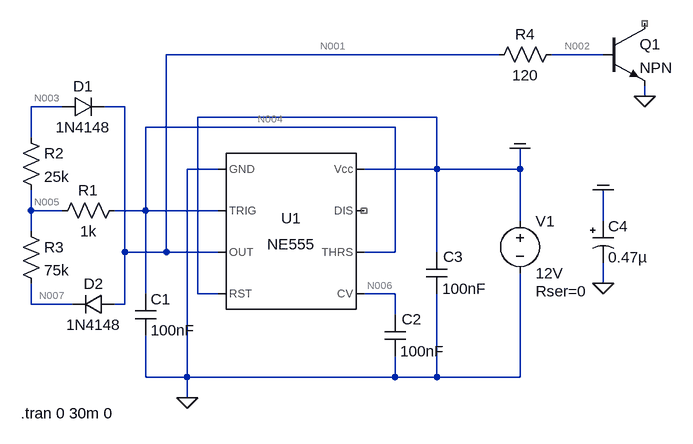
[diagram p0: schematic wil.asc]
wil.asc, the LTspice schematic file:
Version 4
SHEET 1 880 680
WIRE 544 -96 32 -96
WIRE 704 -96 624 -96
WIRE 768 -32 768 -48
WIRE -128 -16 -176 -16
WIRE -32 -16 -64 -16
WIRE 448 0 80 0
WIRE 384 16 0 16
WIRE -176 32 -176 -16
WIRE 112 80 64 80
WIRE 448 80 448 0
WIRE 448 80 336 80
WIRE 576 80 576 48
WIRE 576 80 448 80
WIRE -176 144 -176 112
WIRE -128 144 -176 144
WIRE 0 144 0 16
WIRE 0 144 -48 144
WIRE 112 144 0 144
WIRE 576 160 576 80
WIRE 704 160 704 112
WIRE -176 176 -176 144
WIRE -32 208 -32 -16
WIRE 32 208 32 -96
WIRE 32 208 -32 208
WIRE 112 208 32 208
WIRE 384 208 384 16
WIRE 384 208 336 208
WIRE 448 208 448 80
WIRE 704 256 704 224
WIRE 0 272 0 144
WIRE 80 272 80 0
WIRE 112 272 80 272
WIRE 384 272 336 272
WIRE -176 288 -176 256
WIRE -112 288 -176 288
WIRE -32 288 -32 208
WIRE -32 288 -48 288
WIRE 384 304 384 272
WIRE 0 400 0 336
WIRE 64 400 64 80
WIRE 64 400 0 400
WIRE 384 400 384 368
WIRE 384 400 64 400
WIRE 448 400 448 272
WIRE 448 400 384 400
WIRE 576 400 576 240
WIRE 576 400 448 400
WIRE 64 432 64 400
FLAG 64 432 0
FLAG 704 256 0
FLAG 576 48 COM
FLAG 704 112 COM
FLAG 768 -32 0
SYMBOL Misc\\NE555 224 176 R0
SYMATTR InstName U1
SYMBOL diode -128 0 R270
WINDOW 0 32 32 VTop 2
WINDOW 3 0 32 VBottom 2
SYMATTR InstName D1
SYMATTR Value 1N4148
SYMBOL diode -48 272 R90
WINDOW 0 0 32 VBottom 2
WINDOW 3 32 32 VTop 2
SYMATTR InstName D2
SYMATTR Value 1N4148
SYMBOL res -32 128 R90
WINDOW 0 0 56 VBottom 2
WINDOW 3 32 56 VTop 2
SYMATTR InstName R1
SYMATTR Value 1k
SYMBOL res -192 16 R0
SYMATTR InstName R2
SYMATTR Value 25k
SYMBOL res -192 160 R0
SYMATTR InstName R3
SYMATTR Value 75k
SYMBOL cap -16 272 R0
SYMATTR InstName C1
SYMATTR Value 100nF
SYMBOL cap 368 304 R0
WINDOW 0 26 7 Left 2
SYMATTR InstName C2
SYMATTR Value 100nF
SYMBOL cap 432 208 R0
WINDOW 0 26 7 Left 2
SYMATTR InstName C3
SYMATTR Value 100nF
SYMBOL voltage 576 144 R0
WINDOW 123 0 0 Left 2
WINDOW 39 24 124 Left 2
SYMATTR SpiceLine Rser=0
SYMATTR InstName V1
SYMATTR Value 12V
SYMBOL polcap 688 160 R0
WINDOW 3 24 56 Left 2
SYMATTR InstName C4
SYMATTR Value 0.47µ
SYMATTR Description Capacitor
SYMATTR Type cap
SYMATTR SpiceLine V=50 Irms=22m Rser=3.9 Lser=0 mfg="Nichicon" pn="UPL1HR47MAH" type="Al electrolytic"
SYMBOL res 640 -112 R90
WINDOW 0 0 56 VBottom 2
WINDOW 3 32 56 VTop 2
SYMATTR InstName R4
SYMATTR Value 120
SYMBOL npn 704 -144 R0
SYMATTR InstName Q1
TEXT -192 456 Left 2 !.tran 0 30m 0

The netlist it stands for:
* wil.asc
XU1 0 N004 N001 COM N006 N004 NC_01 COM NE555  ; pins GND TRIG OUT RST CV THRS DIS Vcc
D1 N003 N001 1N4148
D2 N001 N007 1N4148
R1 N004 N005 1k
R2 N003 N005 25k
R3 N005 N007 75k
C1 N004 0 100nF
C2 N006 0 100nF
C3 COM 0 100nF
V1 COM 0 12V Rser=0
C4 COM 0 0.47µ V=50 Irms=22m Rser=3.9 Lser=0 mfg="Nichicon" pn="UPL1HR47MAH" type="Al electrolytic"
R4 N002 N001 120
Q1 NC_02 N002 0 0 NPN
.model D D
.lib standard.dio
.model NPN NPN
.model PNP PNP
.lib standard.bjt
.tran 0 30m 0
.lib NE555.sub
.backanno
.end

* Results of the author's LTspice run, read from the files saved beside the schematic
* Operating Point, zero values left out:
*   V(n004) = 11.37 V
*   V(n006) = 8 V
*   V(com) = 12 V
*   V(n001) = 11.47 V
*   V(n003) = 11.37 V
*   V(n007) = 11.37 V
*   V(n005) = 11.37 V
*   V(n002) = 907.5 mV
*   Ib(Q1) = 88.04 mA
*   Ie(Q1) = -88.04 mA
*   I(D2) = 20.49 nA
*   I(D1) = -2.253 nA
*   I(R4) = -88.04 mA
*   I(R3) = -20.49 nA
*   I(R2) = 2.253 nA
*   I(R1) = -22.74 nA
*   I(V1) = -91.92 mA
*   Ix(u1:1) = -3.881 mA
*   Ix(u1:2) = 11.37 nA
*   Ix(u1:3) = -88.04 mA
*   Ix(u1:4) = 69.33 µA
*   Ix(u1:6) = 11.37 nA
*   Ix(u1:8) = 91.85 mA
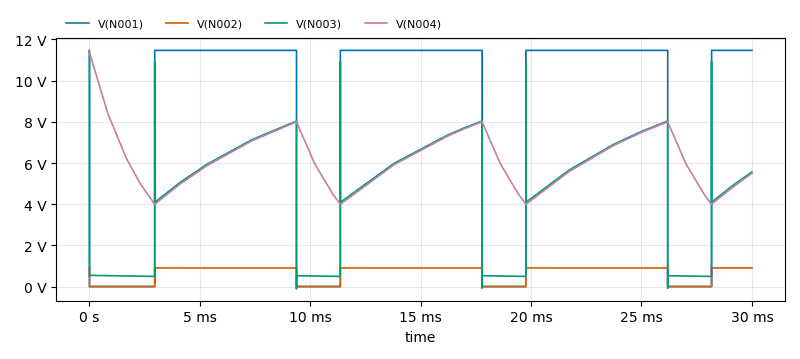
[diagram p1: Transient Analysis of wil.asc, plotted from the saved traces]
* Transient Analysis, 1 run:
*   V(N001): min 880.8 µV, max 11.47 V, average 8.063 V, rms 9.617 V, last 11.47 V
*   V(N002): min 880.8 µV, max 907.5 mV, average 638.2 mV, rms 760.8 mV, last 907.5 mV
*   V(N003): min -106.1 mV, max 11.37 V, average 4.502 V, rms 5.302 V, last 5.567 V
*   V(N004): min 3.999 V, max 11.37 V, average 6.148 V, rms 6.32 V, last 5.494 V